# EAGLE design bliplace (EAGLE 5.07)
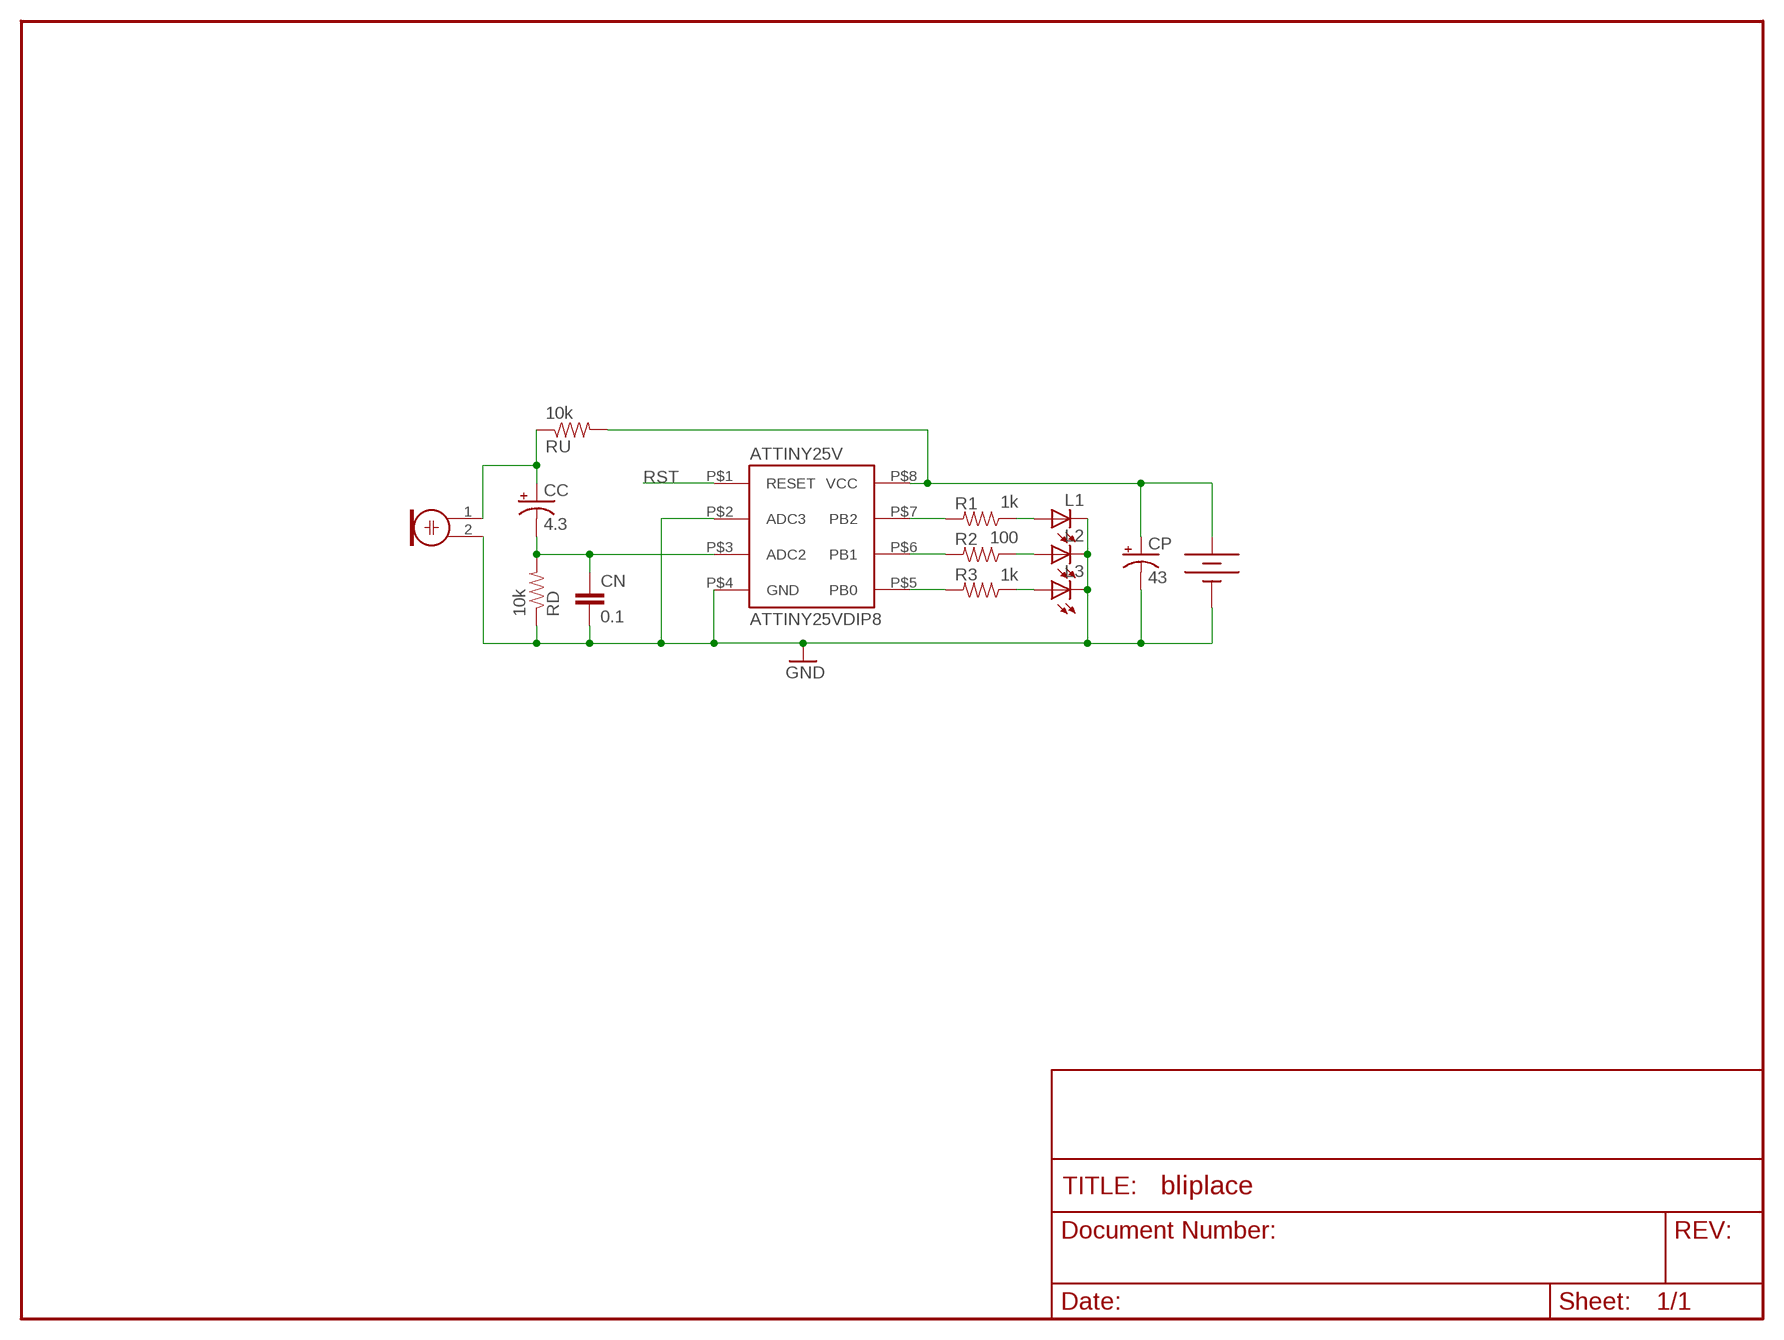
[diagram p0: schematic, sheet 1]

## Parts
ATTINY25V  ATTINY25VDIP8  [DIP8]
CC  4.3  0501  [050_020_1]
CN  0.1  CAP_TANJ  [CAP3MM]
CP  43  0501  [050_020_1]
L1  LED  [LED5MM]
L2  LED  [LED5MM]
L3  LED  [LED5MM]
MIC  ELECTRET_MICROPHON-WM.64PN  [WM-64PN]
R1  1k  RES_TANJRES3MM  [RES3MM]
R2  100  RES_TANJRES3MM  [RES3MM]
R3  1k  RES_TANJRES3MM  [RES3MM]
RD  10k  RES_TANJRES3MM  [RES3MM]
RU  10k  RES_TANJRES3MM  [RES3MM]
U$5  CR2032H  [COIN20MM]

## Nets
AIN: ATTINY25V.P$3(ADC2) CC.- CN.P$1 RD.P$2
GND: ATTINY25V.P$2(ADC3) ATTINY25V.P$4(GND) CN.P$2 CP.- L1.C L2.C L3.C MIC.2 RD.P$1 U$5.N(-)
MIC+: CC.+ MIC.1 RU.P$1
MISO: ATTINY25V.P$6(PB1) R2.P$2
MOSI: ATTINY25V.P$5(PB0) R3.P$2
N$1: L1.A R1.P$1
N$3: L2.A R2.P$1
N$5: L3.A R3.P$1
RST: ATTINY25V.P$1(RESET)
SCL: ATTINY25V.P$7(PB2) R1.P$2
VCC: ATTINY25V.P$8(VCC) CP.+ RU.P$2 U$5.P(+)

## Library data of the parts
ATTINY25V = tanjent:ATTINY25V
CC CP = gm-caps-electro-pol:050: 0.22 - 100uF Xicon values at Mouser.com: 10V: 10 - 100uF; 16V: 2.2 - 47uF; 25V: 0.47 - 47uF; 50V: 0.22 - 22uF
CN = tanjent:CAP_TANJ
L1-L3 = tanjent:LED
MIC = microphon:ELECTRET_MICROPHON-: Electret Condenser Microphone
R1-R3 RD RU = tanjent:RES_TANJ
U$5 = tanjent:CR2032H

## Board
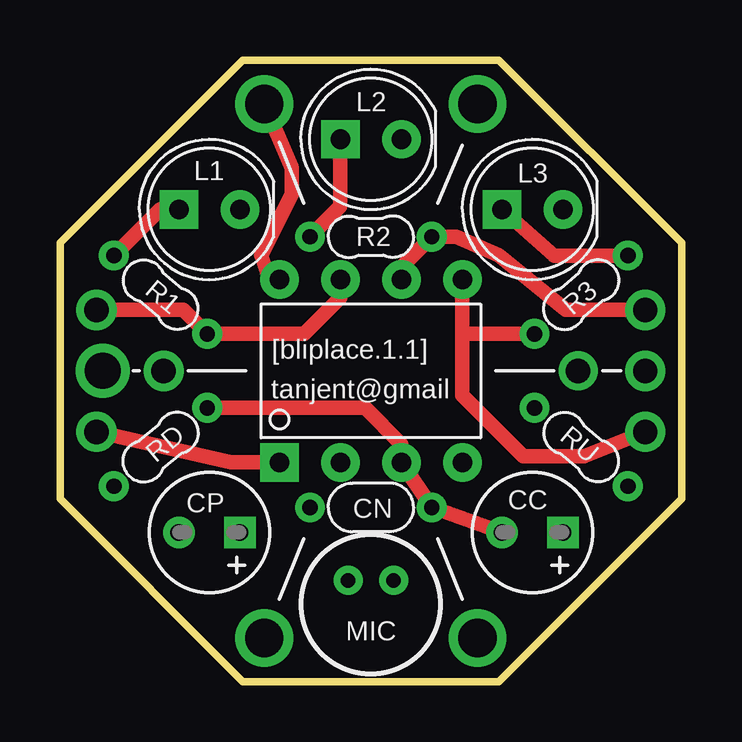
[diagram p1: board, top side]
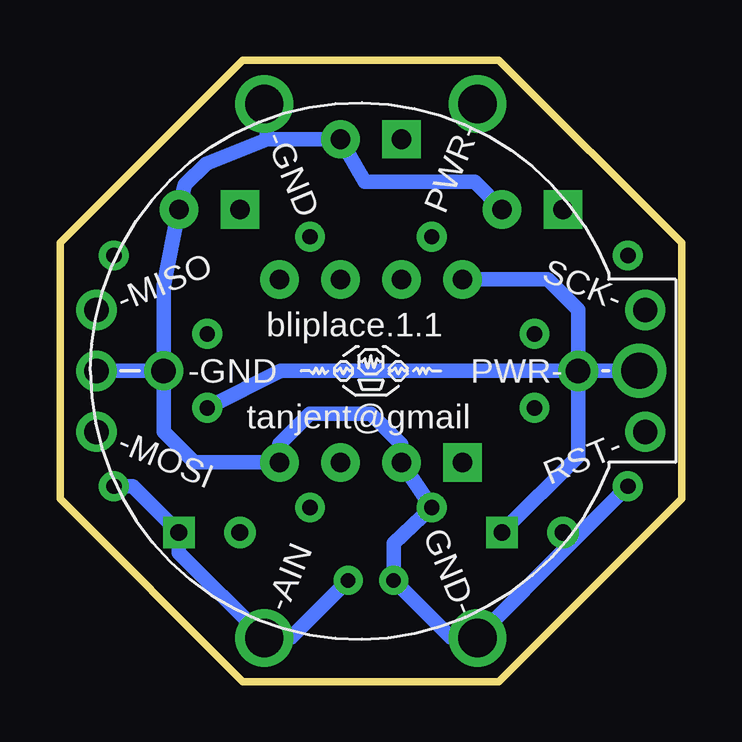
[diagram p2: board, bottom side, seen from below]

Size 25.91 x 25.91 mm. Coordinates in mm from the lower left corner, seen from the top.
Outline: 7.62,0 18.29,0 25.91,7.62 25.91,18.29 18.29,25.91 7.62,25.91 0,18.29 0,7.62 7.62,0
Copper layers (1*16): Top 0.035mm / dielectric 1.5mm / Bottom 0.035mm
Design rules "SparkFun": minimum track width 8mil, minimum drill 20mil, track to track 8mil, track to pad 8mil, pad to pad 8mil, via to via 8mil, smd to smd 8mil, copper to edge 10mil, drill to drill 8mil, minimum pad ring 12mil, minimum via ring 10mil, stop-mask expansion 4mil, vias tented up to drill 25mil, thermal gap 10mil

### Footprints (pad centres in the part's own frame; a part is rotated, then mirrored left to right if it is on the bottom)
DIP8 = drill 0.813 pad 1.6 square: P$1 -3.81,-3.81 | drill 0.813 pad 1.6 round: P$2 -1.27,-3.81; P$3 1.27,-3.81; P$4 3.81,-3.81; P$5 3.81,3.81; P$6 1.27,3.81; P$7 -1.27,3.81; P$8 -3.81,3.81
050_020_1 = drill 0.7 square: + -1.27,0 | drill 0.7 round: - 1.27,0
CAP3MM = drill 0.635 round: P$1 -2.54,0; P$2 2.54,0
LED5MM = drill 0.813 pad 1.6 square: A -1.27,0 | drill 0.813 pad 1.6 round: C 1.27,0
WM-64PN = drill 0.6 pad 1 round: 1 -1,0.95; 2 -1,-0.95
RES3MM = drill 0.635 round: P$1 -2.54,0; P$2 2.54,0
COIN20MM = drill 1.016 round: N -8.128,0 | drill 1.499 round: P 11.684,0

### Placement (x,y rotation side)
ATTINY25V  12.95,12.95 0 top
CC  19.69,6.22 180 top
CN  12.95,7.26 180 top
CP  6.22,6.22 180 top
L1  6.22,19.69 0 top
L2  12.95,22.61 0 top
L3  19.69,19.69 0 top
MIC  12.95,3.23 270 top
R1  4.19,16.13 320 top
R2  12.95,18.54 0 top
R3  21.72,16.13 220 top
RD  4.19,9.78 40 top
RU  21.72,9.78 140 top
U$5  13.46,12.95 0 bottom

### Tracks (layer width: path | path; a pad name or v marks a point on that pad's centre or on a via)
AIN
  Top 0.61: RD.P$2 12.72,11.41 14.22,9.91 ATTINY25V.P$3 CN.P$1 CC.-
GND  (via drill 1.02 pad 1.68, 1.6 pad 1.68)
  Bottom 0.61: U$5.N 21.59,10.41 20.32,9.14 ATTINY25V.P$4 16.76,9.91 15.49,11.18 12.95,11.18 11.68,9.91 ATTINY25V.P$2 CN.P$2 12,5.78 MIC.2 9.61,1.83 v8.51,1.83 8.51,1.88 4.56,5.83 | U$5.N v24.38,12.95 | U$5.N 21.59,16.51 L3.C 20.7,20.7 19.81,21.59 17.27,22.61 | L1.C 8.64,20.83 13.21,20.83 L2.C 17.27,22.61 | 17.27,22.61 v17.4,24.08 | 4.56,5.83 RD.P$1 | CP.- | 4.56,5.83 CP.-
MIC+  (via drill 1.6)
  Bottom 0.61: MIC.1 16.3,1.83 v17.4,1.83 20.95,5.38 CC.+ 22.88,8.15 RU.P$1
MISO  (via drill 1.02 pad 1.68)
  Top 0.61: ATTINY25V.P$6 14.22,17.27 R2.P$2 16.51,18.54 18.29,17.78 21.08,15.49 v24.38,15.49
MOSI  (via drill 1.02 pad 1.68)
  Top 0.61: v24.38,10.41 21.84,9.4 19.3,9.4 16.76,11.94 16.76,14.48 | 16.76,14.48 ATTINY25V.P$5 | R3.P$2 16.78,14.5 16.76,14.48
N$1
  Top 0.61: L1.A 4.17,19.69 R1.P$1
N$3
  Top 0.61: L2.A 11.68,19.81 R2.P$1
N$5
  Top 0.61: R3.P$1 20.59,17.76 L3.A
RST  (via drill 1.02 pad 1.68)
  Top 0.61: ATTINY25V.P$1 7.11,9.14 v1.52,10.41
SCL  (via drill 1.02 pad 1.68)
  Top 0.61: v1.52,15.49 5.14,15.49 R1.P$2 10.18,14.5 11.68,16 ATTINY25V.P$7
VCC  (via drill 1.02 pad 1.68, 1.6 pad 1.68)
  Top 0.61: ATTINY25V.P$8 8.64,17.02 8.38,17.78 9.65,20.32 9.65,21.41 v8.51,24.08
  Bottom 0.61: v4.32,12.95 4.32,15.49 5.59,16.76 ATTINY25V.P$8 | v4.32,12.95 U$5.P | v4.32,12.95 16.7,12.95 RU.P$2 | v4.32,12.95 4.32,9.4 CP.+

### Text on the board
tPlace: [bliplace.1.1] | tanjent@gmail
bPlace: -GND | PWR- | SCK- | -MISO | bliplace.1.1 | PWR- | -GND | tanjent@gmail | -MOSI | RST- | GND- | -AIN
tNames: L2 | L1 | L3